# Altium schematic sheet Sheet1.SchDoc
size A4
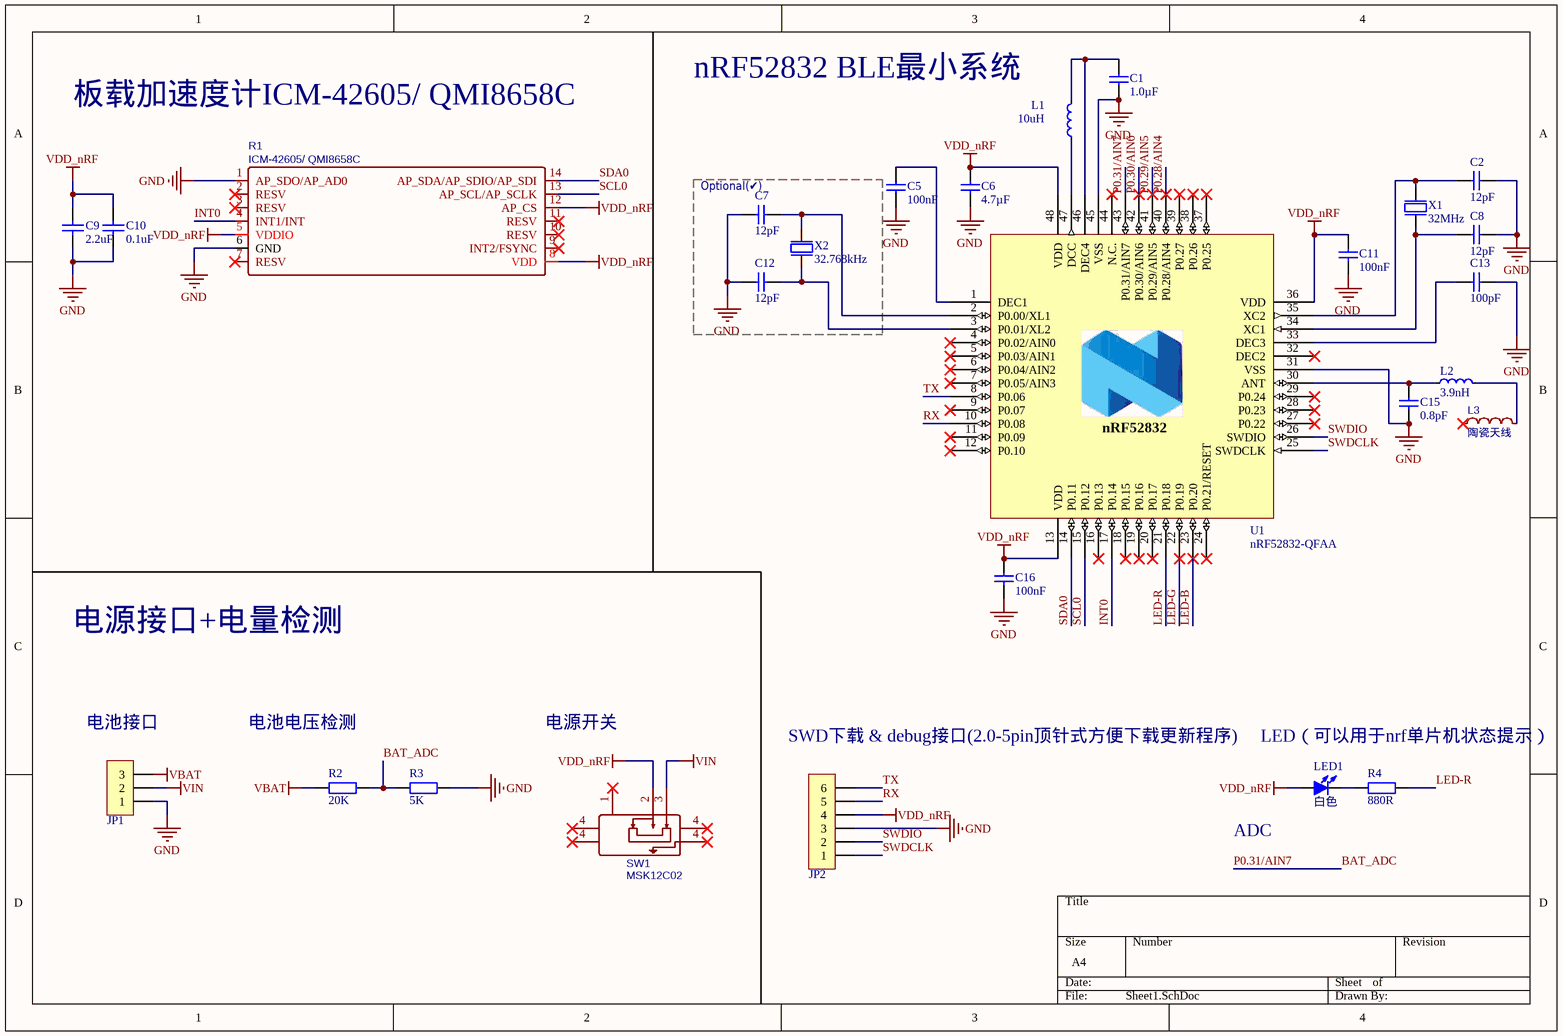
[diagram p0: Sheet1.SchDoc]

## Parts
C1  1.0µF  [C 0402_L]
C2  12pF  [C 0402_L]
C5  100nF  [C 0402_L]
C6  4.7µF  [C 0402_L]
C7  12pF  [C 0402_L]
C8  12pF  [C 0402_L]
C9  2.2uF  [C 0402_L]
C10  0.1uF  [C 0402_L]
C11  100nF  [C 0402_L]
C12  12pF  [C 0402_L]
C13  100pF  [C 0402_L]
C15  0.8pF  [C 0402_L]
C16  100nF  [C 0402_L]
JP1  HDR-1X3  [bat_3p]  (value not drawn)
JP2  HDR-1X6  [SWD_nRF52832]  (value not drawn)
L1  10uH  [INDC1005X04L]
L2  3.9nH  [INDC1005X04L]
L3  陶瓷天线  [ANT-SMD_L3.1-W1.6]
LED1  白色  [LED0402-RD_BLUE]
R1  ICM-42605/ QMI8658C  [ICM-42605]
R2  20K  [R 0402_L]
R3  5K  [R 0402_L]
R4  880R  [R 0402_L]
SW1  MSK12C02  [SW-TH_MSK12C02]
U1  nRF52832-QFAA  [QFN-48_L6.0-W6.0-P0.40-BL-EP3.8]
X1  32MHz  [BT-XTAL_2016]
X2  32.768kHz  [XTAL_3215]

## Blocks framed on the sheet
Optional(✔): C7 C12 X2

## Nets
GND: C1.1 C2.2 C5.2 C6.2 C7.2 C8.2 C9.1 C10.1 C11.2 C12.2 C13.2 C15.1 C16.2 JP1.1 JP2.3 R1.1(AP_SDO/AP_AD0) R1.6(GND) R3.2 U1.31(VSS) U1.45(VSS) U1.49(GND) X1.2(GND) X1.4(GND)
VBAT: JP1.3 R2.1
VDD_nRF: C6.1 C9.2 C10.2 C11.1 C16.1 JP2.4 LED1.1(A) R1.5(VDDIO) R1.8(VDD) R1.12(AP_CS) SW1.2 U1.13(VDD) U1.36(VDD) U1.48(VDD)
VIN: JP1.2 SW1.3
BAT_ADC: R2.2 R3.1 U1.43(P0.31/AIN7)  [also labelled P0.31/AIN7]
INT0: R1.4(INT1/INT) U1.17(P0.14)
LED-B: U1.23(P0.20)
LED-G: U1.22(P0.19)
LED-R: R4.2 U1.21(P0.18)
P0.28/AIN4: U1.40(P0.28/AIN4)
P0.29/AIN5: U1.41(P0.29/AIN5)
P0.30/AIN6: U1.42(P0.30/AIN6)
RX: JP2.5 U1.10(P0.08)
SCL0: R1.13(AP_SCL/AP_SCLK) U1.15(P0.12)
SDA0: R1.14(AP_SDA/AP_SDIO/AP_SDI) U1.14(P0.11)
SWDCLK: JP2.1 U1.25(SWDCLK)
SWDIO: JP2.2 U1.26(SWDIO)
TX: JP2.6 U1.8(P0.06)
NetC1_2: C1.2 L1.2 U1.46(DEC4)
NetC2_1: C2.1 U1.35(XC2) X1.3(out)
NetC5_1: C5.1 U1.1(DEC1)
NetC7_1: C7.1 U1.2(P0.00/XL1) X2.1(inp)
NetC8_1: C8.1 U1.34(XC1) X1.1(inp)
NetC12_1: C12.1 U1.3(P0.01/XL2) X2.2(out)
NetC13_1: C13.1 U1.33(DEC3)
NetC15_2: C15.2 L2.1 U1.30(ANT)
NetL1_1: L1.1 U1.47(DCC)
NetL2_2: L2.2 L3.2
NetLED1_2: LED1.2(K) R4.1

Not connected (* = marked no-connect by the designer): L3 1*; R1 2(RESV)* 3(RESV)* 7(RESV)* 9(INT2/FSYNC)* 10(RESV)* 11(RESV)*; SW1 1* 4*; U1 4(P0.02/AIN0)* 5(P0.03/AIN1)* 6(P0.04/AIN2)* 7(P0.05/AIN3)* 9(P0.07)* 11(P0.09)* 12(P0.10)* 16(P0.13)* 18(P0.15)* 19(P0.16)* 20(P0.17)* 24(P0.21/RESET)* 27(P0.22)* 28(P0.23)* 29(P0.24)* 32(DEC2)* 37(P0.25)* 38(P0.26)* 39(P0.27)* 44(N.C.)*

## Notes on the sheet
- 板载加速度计ICM-42605/ QMI8658C
- nRF52832 BLE最小系统
- 电源接口+电量检测
- (near JP1) 电池接口
- 电池电压检测
- 电源开关
- (near JP2) SWD下载 & debug接口(2.0-5pin顶针式方便下载更新程序)
- LED（可以用于nrf单片机状态提示）
- ADC
- Labels drawn without touching a wire or pin: ADC1, ADC2, ADC3
- (in symbol nRF52832-QFAA) nRF52832

## Library data of the parts
C1 = C0603-1µ0: Capacitor, X7R, ±10%; Note: 16V; Artikkelnr Noca: 20039335; Artikkelnr Simpro: N.A.; Part Number: C0603-1µ0; Manufacturer: *; Manufacturer Part Number: *; Datasheet: *; LatestRevisionDate: 2013-06-05; Pin Count: 2; Publisher: Nordic Semiconductor; Published: 2009-05-08; Value: 1.0µF; Supplier: *; Supplier part number: *; 2nd source Supplier: *; 2nd source part number: *; Footprint Doc: 0603
C2 C7 C8 C12 = C0402-12p: Capacitor, NP0, ±2%; Note: 50V; Artikkelnr Noca: 20029159; Artikkelnr Simpro: N.A.; Part Number: C0402-12p; Manufacturer: *; Manufacturer Part Number: *; Datasheet: *; LatestRevisionDate: 2011-05-11; Pin Count: 2; Publisher: Nordic Semiconductor; Published: 2009-05-08; Value: 12pF; Supplier: *; Supplier part number: *; 2nd source Supplier: *; 2nd source part number: *; Footprint Doc: 0402
C5 C11 C16 = C0402-100n: Capacitor, X7R, ±10%; Note: 16V; Artikkelnr Noca: 20039200; Artikkelnr Simpro: N.A.; Part Number: C0402-100n; Manufacturer: *; Manufacturer Part Number: *; Datasheet: *; LatestRevisionDate: 2009-11-23; Pin Count: 2; Publisher: Nordic Semiconductor; Published: 2009-05-08; Value: 100nF; Supplier: *; Supplier part number: *; 2nd source Supplier: *; 2nd source part number: *; Footprint Doc: 0402
C6 = C0603-4µ7: Capacitor, X5R, ±10%; Note: 6.3V; Artikkelnr Noca: 20069060; Artikkelnr Simpro: N.A.; Part Number: C0603-4µ7; Manufacturer: *; Manufacturer Part Number: *; Datasheet: *; LatestRevisionDate: 2009-11-23; Pin Count: 2; Publisher: Nordic Semiconductor; Published: 2009-05-08; Value: 4.7µF; Supplier: *; Supplier part number: *; 2nd source Supplier: *; 2nd source part number: *; Footprint Doc: 0603
C9 C10 = Cap: Capacitor; Published: 8-Jun-2000; LatestRevisionDate: 17-Jul-2002; LatestRevisionNote: Re-released for DXP Platform.; PackageReference: RAD-0.3; Publisher: Altium Limited; PackageDescription: Radial Cap, Thru-Hole; 2 Leads; 0.3 in Pin Spacing
  C9: Value: 2.2uF
  C10: Value: 0.1uF
C13 = C0402-100p: Capacitor, NP0, ±5%; Note: 50V; Artikkelnr Noca: 20029135; Artikkelnr Simpro: N.A.; Part Number: C0402-100p; Manufacturer: *; Manufacturer Part Number: *; Datasheet: *; LatestRevisionDate: 2009-05-08; Pin Count: 2; Publisher: Nordic Semiconductor; Published: 2009-05-08; Value: 100pF; Supplier: *; Supplier part number: *; 2nd source Supplier: *; 2nd source part number: *; Footprint Doc: 0402
C15 = C0402-0.8p: Capacitor, NP0, ±5%; Note: 50V; Artikkelnr Noca: 20029147; Artikkelnr Simpro: N.A.; Part Number: C0402-0.8p; Manufacturer: *; Manufacturer Part Number: *; Datasheet: *; LatestRevisionDate: 2012-11-21; Pin Count: 2; Publisher: Nordic Semiconductor; Published: 2009-05-08; Value: 0.8pF; Supplier: *; Supplier part number: *; 2nd source Supplier: *; 2nd source part number: *; Footprint Doc: 0402
JP1 = Header 3: 3P接插件; 版权归属: 源创客; BOM名称: 3P接插件; 学习资源: www.ooocke.com
JP2 = Header 6: 6P接插件; 版权归属: 源创客; BOM名称: 6P接插件; 学习资源: www.ooocke.com
L1 = L0402-3n9: High frequency chip inductor ±5%; Manufacturer: Murata; Manufacturer Part Number: LQP15MN3N9B02D; Value: 3.9nH; Artikkelnr Noca: 33029151; Artikkelnr Simpro: N.A.; Part Number: L0402-3n9; Datasheet: http://search.murata.co.jp/Ceramy/image/img/PDF/ENG/L0075S0084LQP15M.pdf; LatestRevisionDate: 2012-09-19; Pin Count: 2; Publisher: Nordic Semiconductor; Published: 2009-05-08; Note: High frequency chip inductor ±5%; Supplier: Digi-Key; Supplier part number: 490-1131-1-ND; 2nd source Supplier: *; 2nd source part number: *; Footprint Doc: 0402
L2 = L0402-3n9: High frequency chip inductor ±5%; Manufacturer: Murata; Manufacturer Part Number: LQP15MN3N9B02D; Artikkelnr Noca: 33029151; Artikkelnr Simpro: N.A.; Part Number: L0402-3n9; Datasheet: http://search.murata.co.jp/Ceramy/image/img/PDF/ENG/L0075S0084LQP15M.pdf; LatestRevisionDate: 2012-09-19; Pin Count: 2; Publisher: Nordic Semiconductor; Published: 2009-05-08; Value: 3.9nH; Note: High frequency chip inductor ±5%; Supplier: Digi-Key; Supplier part number: 490-1131-1-ND; 2nd source Supplier: *; 2nd source part number: *; Footprint Doc: 0402
L3 = Huaxin: BOM_Manufacturer: Huaxin S&T; BOM_Manufacturer Part: RFECA3216060A1T; nameAlias: Value; Contributor: LCSC; BOM_Supplier: LCSC; BOM_Supplier Part: C127620; BOM_JLCPCB Part Class: Extended Part; spicePre: L; spiceSymbolName: RFECA3216060A1T
LED1 = LED-SMD: 贴片LED; 版权归属: 源创客; BOM名称: 贴片LED; 学习资源: www.ooocke.com
R1 = ICM-42605: BOM_Manufacturer: InvenSense; Contributor: LCSC; BOM_Supplier: LCSC; BOM_Supplier Part: C2655099; BOM_Manufacturer Part: ICM-42605; BOM_JLCPCB Part Class: Extended Part; spicePre: R; spiceSymbolName: ICM-42605
R2-R4 = R: 贴片电阻; 版权归属: 源创客; BOM名称: 贴片电阻; 学习资源: www.ooocke.com
SW1 = MSK12C02: BOM_Manufacturer: SHOU HAN(首韩); Contributor: LCSC; BOM_Supplier: LCSC; BOM_Supplier Part: C431540; BOM_Manufacturer Part: MSK12C02; BOM_JLCPCB Part Class: Extended Part; spicePre: S; spiceSymbolName: MSK12C02
U1 = nRF52832-QFAA: Multi-protocol Bluetooth Low Energy, ANT and 2.4GHz proprietary system-on-chip; Manufacturer: Nordic Semiconductor; Artikkelnr Noca: N.A.; Part Number: nRF52832-QFAA; Manufacturer Part Number: nRF52832-QFAA; Datasheet: *; LatestRevisionDate: 2014-11-26; Pin Count: 48; Publisher: Nordic Semiconductor; Published: 2014-11-26; Value: nRF52832-QFAA; Note: *; Supplier: Nordic Semiconductor; Supplier part number: *; 2nd source Supplier: *; 2nd source part number: *; Footprint Doc: QFN-48; Artikkelnr Simpro: N.A.
X1 = XTAL_SMD2016_32MHz_8pF_General: XTAL SMD 2016, 32MHz, Cl=8pF, Total Tol: ±40ppm; Note: XTAL SMD 32.000MHz; Artikkelnr Noca: N.A.; Part Number: XTAL_SMD2016_32MHz_8pF_General; Manufacturer: *; Manufacturer Part Number: *; Datasheet: *; LatestRevisionDate: 2016-08-19; Pin Count: 4; Publisher: Nordic Semiconductor; Published: 2016-08-19; Value: 32MHz; Supplier: *; Supplier part number: *; 2nd source Supplier: *; 2nd source part number: *; Footprint Doc: XTAL_2016; Artikkelnr Simpro: N.A.
X2 = XTAL_SMD3215_32.768kHz_9pF_General: XTAL SMD 3215, 32.768kHz, Cl=9pF, Total Tol: ±50ppm; Note: XTAL SMD 32.768kHz; Artikkelnr Noca: N.A.; Part Number: XTAL_SMD3215_32.768kHz_9pF_General; Manufacturer: *; Manufacturer Part Number: *; Datasheet: *; LatestRevisionDate: 2016-08-19; Pin Count: 2; Publisher: Nordic Semiconductor; Published: 2016-08-19; Value: 32.768kHz; Supplier: *; Supplier part number: *; 2nd source Supplier: *; 2nd source part number: *; Footprint Doc: XTAL_3215; Artikkelnr Simpro: N.A.